# EAGLE schematic OLDbattery_board (EAGLE 7.4.0)
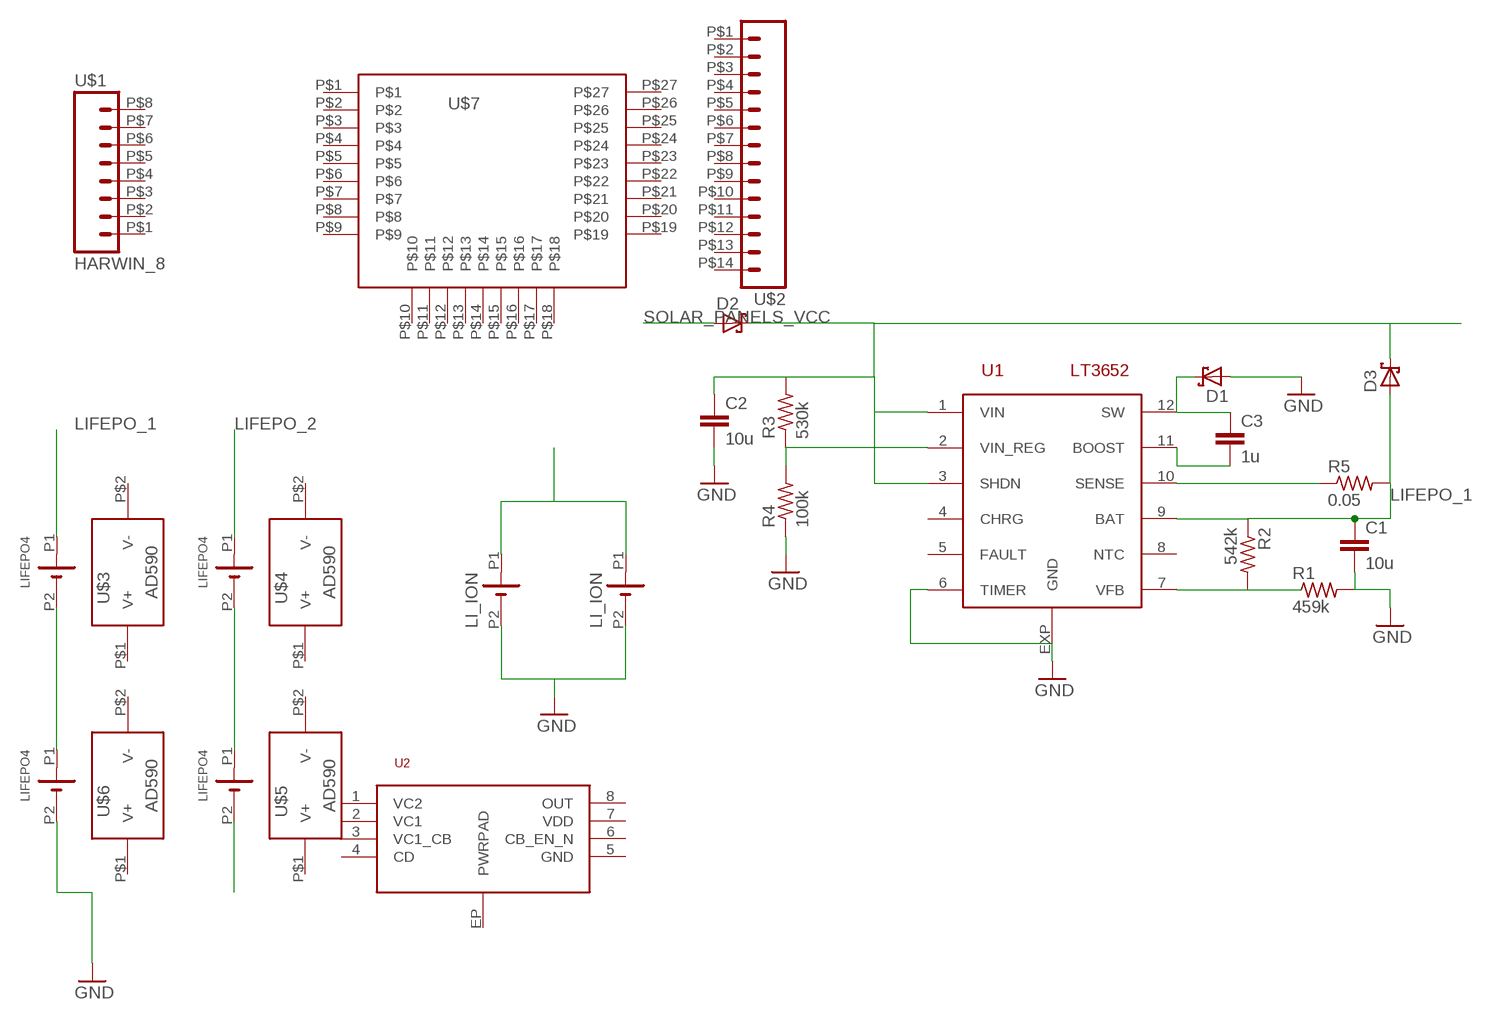
[diagram p0: schematic, sheet 1]

## Parts
C1  10u  C-EUC1210  [C1210]
C2  10u  C-EUC1210  [C1210]
C3  1u  C-EUC0805  [C0805]
D1  SCHOTTKY-DIODE  [SOD123]
D2  SCHOTTKY-DIODE  [SOD123]
D3  SCHOTTKY-DIODE  [SOD123]
LFP1  LIFEPO4  [LIFEPO4]
LFP2  LIFEPO4  [LIFEPO4]
LFP3  LIFEPO4  [LIFEPO4]
LFP4  LIFEPO4  [LIFEPO4]
R1  459k  R-US_R0805  [R0805]
R2  542k  R-US_R0805  [R0805]
R3  530k  R-US_R0805  [R0805]
R4  100k  R-US_R0805  [R0805]
R5  0.05  R-US_R0805  [R0805]
U1  LT3652  [MSOP12]
U2  BQ29209  [VSON8]
U$1  HARWIN_8  [HARWIN_8]
U$2  HARWIN_14  [HARWIN_DATAMATE_14]
U$3  AD590-TH  [AD590TH]
U$4  AD590-TH  [AD590TH]
U$5  AD590-TH  [AD590TH]
U$6  AD590-TH  [AD590TH]
U$7  HARWIN_27  [HARWIN_DATAMATE_27]
U$8  LI_ION  [LI_ION]
U$9  LI_ION  [LI_ION]

## Nets
GND: C1.2 C2.2 D1.A LFP3.P2(-) R1.2 R4.1 U1.6(TIMER) U1.EXP(GND) U$8.P2(-) U$9.P2(-)
LIFEPO_1: C1.1 D3.A LFP1.P1(+) R2.1 R5.2 U1.9(BAT)
LIFEPO_2: LFP2.P1(+)
N$1: LFP1.P2(-) LFP3.P1(+)
N$2: LFP2.P2(-) LFP4.P1(+)
N$5: U$8.P1(+) U$9.P1(+)
N$6: R3.1 R4.2 U1.2(VIN_REG)
N$8: R2.2 U1.7(VFB)
N$9: R5.1 U1.10(SENSE)
N$10: C2.1 D2.C D3.C R3.2 U1.1(VIN) U1.3(SHDN)
N$11: C3.1 D1.C U1.12(SW)
N$12: C3.2 U1.11(BOOST)
N$13: LFP4.P2(-)
SOLAR_PANELS_VCC: D2.A
Unconnected: R1.1 U1.4(CHRG) U1.5(FAULT) U1.8(NTC) U2.1(VC2) U2.2(VC1) U2.3(VC1_CB) U2.4(CD) U2.5(GND) U2.6(CB_EN_N) U2.7(VDD) U2.8(OUT) U2.EP(PWRPAD) U$1.P$1 U$1.P$2 U$1.P$3 U$1.P$4 U$1.P$5 U$1.P$6 U$1.P$7 U$1.P$8 U$2.P$1 U$2.P$2 U$2.P$3 U$2.P$4 U$2.P$5 U$2.P$6 U$2.P$7 U$2.P$8 U$2.P$9 U$2.P$10 U$2.P$11 U$2.P$12 U$2.P$13 U$2.P$14 U$3.P$1(V+) U$3.P$2(V-) U$4.P$1(V+) U$4.P$2(V-) U$5.P$1(V+) U$5.P$2(V-) U$6.P$1(V+) U$6.P$2(V-) U$7.P$1 U$7.P$2 U$7.P$3 U$7.P$4 U$7.P$5 U$7.P$6 U$7.P$7 U$7.P$8 U$7.P$9 U$7.P$10 U$7.P$11 U$7.P$12 U$7.P$13 U$7.P$14 U$7.P$15 U$7.P$16 U$7.P$17 U$7.P$18 U$7.P$19 U$7.P$20 U$7.P$21 U$7.P$22 U$7.P$23 U$7.P$24 U$7.P$25 U$7.P$26 U$7.P$27

## Library data of the parts
C1-C3 = resistor:C-EU: CAPACITOR, European symbol
D1-D3 = BattBoard:SCHOTTKY-DIODE: Schottky Diode
LFP1-LFP4 = BattBoard:LIFEPO4
R1-R5 = resistor:R-US_: RESISTOR, American symbol
U1 = BattBoard:LT3652
U2 = BattBoard:BQ29209
U$1 = Drvr_Board_Conn:HARWIN_8
U$2 = CNTRL_BOARD:HARWIN_14
U$3-U$6 = CNTRL_BOARD:AD590-TH
U$7 = CNTRL_BOARD:HARWIN_27
U$8 U$9 = BattBoard:LI_ION